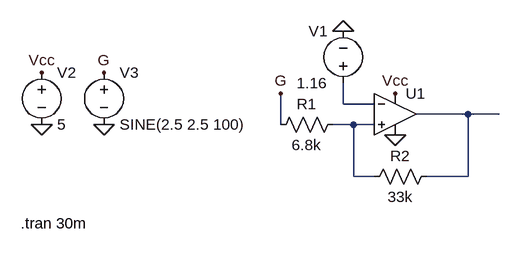
[diagram p0: schematic Shcmitt trigger.asc]
Shcmitt trigger.asc, the LTspice schematic file:
Version 4.1
SHEET 1 880 680
WIRE 288 128 288 96
WIRE 336 128 288 128
WIRE 480 144 400 144
WIRE 528 144 480 144
WIRE 192 160 192 112
WIRE 304 160 272 160
WIRE 336 160 304 160
WIRE 304 240 304 160
WIRE 336 240 304 240
WIRE 480 240 480 144
WIRE 480 240 416 240
FLAG 368 176 0
FLAG 368 112 Vcc
FLAG 288 16 0
FLAG -176 80 Vcc
FLAG -176 160 0
FLAG -80 80 G
FLAG -80 160 0
FLAG 192 112 G
SYMBOL res 288 144 R90
WINDOW 0 0 56 VBottom 2
WINDOW 3 32 56 VTop 2
SYMATTR InstName R1
SYMATTR Value 6.8k
SYMBOL OpAmps\\UniversalOpAmp2 368 144 R0
SYMATTR InstName U1
SYMBOL res 432 224 R90
WINDOW 0 0 56 VBottom 2
WINDOW 3 32 56 VTop 2
SYMATTR InstName R2
SYMATTR Value 33k
SYMBOL voltage 288 112 R180
WINDOW 0 24 96 Left 2
WINDOW 3 24 16 Left 2
WINDOW 123 0 0 Left 0
WINDOW 39 0 0 Left 0
SYMATTR InstName V1
SYMATTR Value 1.16
SYMBOL voltage -176 64 R0
WINDOW 123 0 0 Left 0
WINDOW 39 0 0 Left 0
SYMATTR InstName V2
SYMATTR Value 5
SYMBOL voltage -80 64 R0
WINDOW 123 0 0 Left 0
WINDOW 39 0 0 Left 0
SYMATTR InstName V3
SYMATTR Value SINE(2.5 2.5 100)
TEXT -208 312 Left 2 !.tran 30m

The netlist it stands for:
* Shcmitt trigger.asc
R1 N003 G 6.8k
X§U1 N003 N001 Vcc 0 N002 level2 Avol=1Meg GBW=10Meg Slew=10Meg Ilimit=25m Rail=0 Vos=0 En=0 Enk=0 In=0 Ink=0 Rin=500Meg  ; pins In+ In- V+ V- OUT
R2 N002 N003 33k
V1 N001 0 1.16
V2 Vcc 0 5
V3 G 0 SINE(2.5 2.5 100)
.tran 30m
.lib UniversalOpAmp2.lib
.backanno
.end